# EAGLE schematic new (EAGLE 9.6.1)
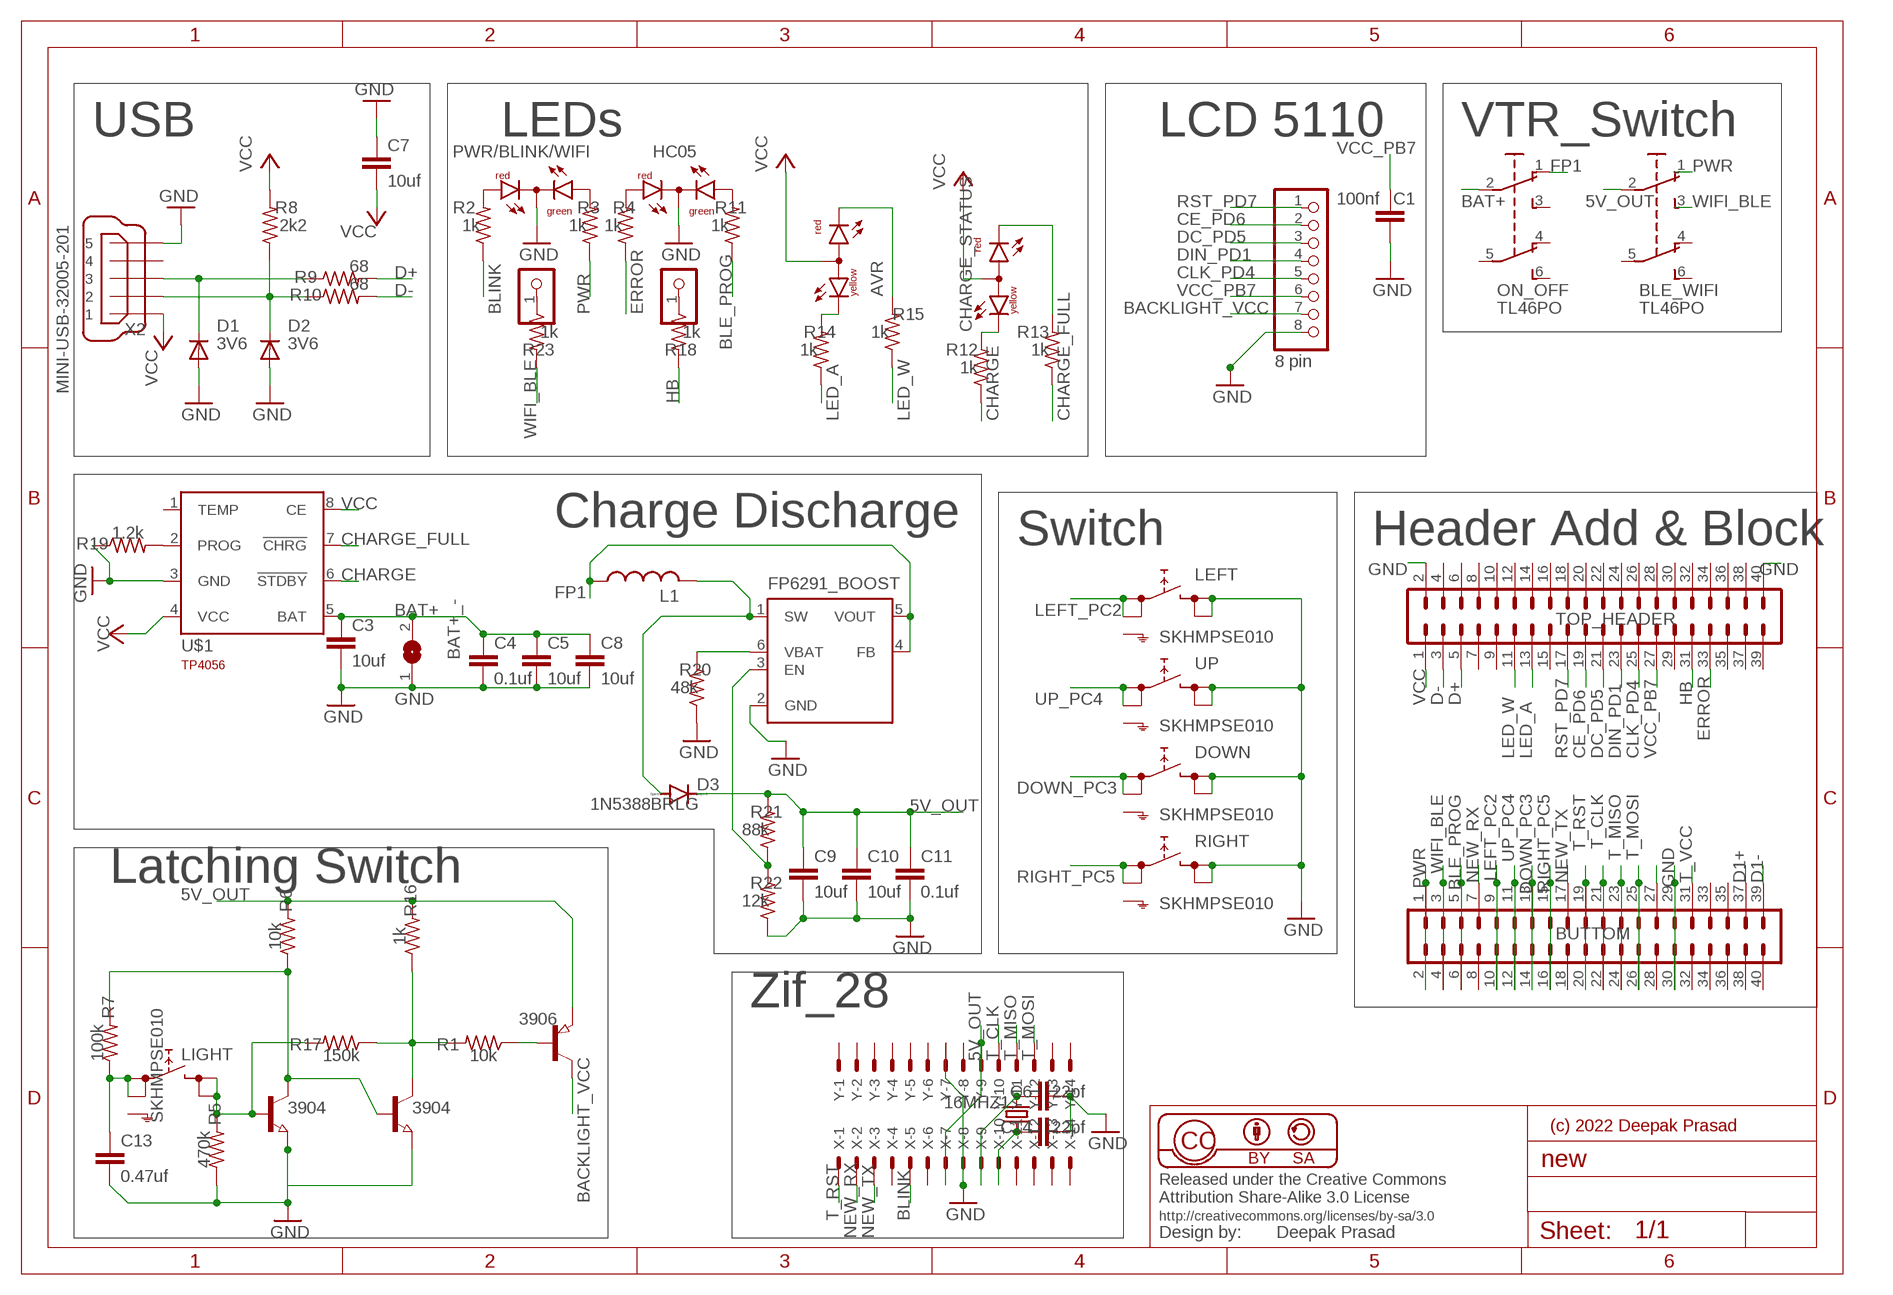
[diagram p0: schematic, sheet 1]

## Parts
16MHZ1  CSM-7X-DU  [CSM-7X-DU]
3906  PNP-TRANSISTOR_SOT23  [SOT23]
AVR  DUOLED-RY-A  [DUOLED-A-5MM]
BAT+_-  SJW  [SJW]
BLE_WIFI  TL46PO  [TL4XPO]
BUTTOM  MA20-2  [MA20-2]
C1  100nf  C-EUC1206  [C1206]
C3  10uf  C-EUC1206  [C1206]
C4  0.1uf  C-EUC1206  [C1206]
C5  10uf  C-EUC1206  [C1206]
C6  22pf  C-EUC1206  [C1206]
C7  10uf  C-EUC1206  [C1206]
C8  10uf  C-EUC1206  [C1206]
C9  10uf  C-EUC1206  [C1206]
C10  10uf  C-EUC1206  [C1206]
C11  0.1uf  C-EUC1206  [C1206]
C13  0.47uf  C-EUC1206  [C1206]
C14  22pf  C-EUC1206  [C1206]
CHARGE_STATUS  DUOLED-RY-A  [DUOLED-A-5MM]
D1  3V6  DIODESMA  [SMA-DIODE]
D2  3V6  DIODESMA  [SMA-DIODE]
D3  1N5388BRLG  DIODE-SMC  [SMC]
DOWN  SKHMPSE010  [SKHMPXE010]
FP6291_BOOST  TPS61070DDC  [TSOT23-6_DDC]
HC05  DUOLED-RG-C  [DUOLED-C-5MM]
JP1  8 pin  PINHD-1X8  [1X08]
JP2  PINHD-1X1  [1X01]
JP3  PINHD-1X1  [1X01]
L1  L-USPIS2816  [PIS2816]
LEFT  SKHMPSE010  [SKHMPXE010]
LIGHT  SKHMPSE010  [SKHMPXE010]
ON_OFF  TL46PO  [TL4XPO]
PWR/BLINK/WIFI  DUOLED-RG-C  [DUOLED-C-5MM]
Q2  3904  NPN-TRANSISTOR_SOT23  [SOT23]
Q3  3904  NPN-TRANSISTOR_SOT23  [SOT23]
R1  10k  R-US_CHIP-1206(3216-METRIC)  [RESC3216X70]
R2  1k  R-US_CHIP-1206(3216-METRIC)  [RESC3216X70]
R3  1k  R-US_CHIP-1206(3216-METRIC)  [RESC3216X70]
R4  1k  R-US_CHIP-1206(3216-METRIC)  [RESC3216X70]
R5  470k  R-US_CHIP-1206(3216-METRIC)  [RESC3216X70]
R6  10k  R-US_CHIP-1206(3216-METRIC)  [RESC3216X70]
R7  100k  R-US_CHIP-1206(3216-METRIC)  [RESC3216X70]
R8  2k2  R-US_CHIP-1206(3216-METRIC)  [RESC3216X70]
R9  68  R-US_CHIP-1206(3216-METRIC)  [RESC3216X70]
R10  68  R-US_CHIP-1206(3216-METRIC)  [RESC3216X70]
R11  1k  R-US_CHIP-1206(3216-METRIC)  [RESC3216X70]
R12  1k  R-US_CHIP-1206(3216-METRIC)  [RESC3216X70]
R13  1k  R-US_CHIP-1206(3216-METRIC)  [RESC3216X70]
R14  1k  R-US_CHIP-1206(3216-METRIC)  [RESC3216X70]
R15  1k  R-US_CHIP-1206(3216-METRIC)  [RESC3216X70]
R16  1k  R-US_CHIP-1206(3216-METRIC)  [RESC3216X70]
R17  150k  R-US_CHIP-1206(3216-METRIC)  [RESC3216X70]
R18  1k  R-US_CHIP-1206(3216-METRIC)  [RESC3216X70]
R19  1.2k  R-US_CHIP-1206(3216-METRIC)  [RESC3216X70]
R20  48k  R-US_CHIP-1206(3216-METRIC)  [RESC3216X70]
R21  88k  R-US_CHIP-1206(3216-METRIC)  [RESC3216X70]
R22  12k  R-US_CHIP-1206(3216-METRIC)  [RESC3216X70]
R23  1k  R-US_CHIP-1206(3216-METRIC)  [RESC3216X70]
RIGHT  SKHMPSE010  [SKHMPXE010]
TOP_HEADER  MA20-2  [MA20-2]
U$1  TP4056  [SOT23-8]
UP  SKHMPSE010  [SKHMPXE010]
X  C-GRID-14-70543  [70543-14]
X2  MINI-USB-32005-201  [32005-201]
Y  C-GRID-14-70543  [70543-14]

## Nets
5V_OUT: 3906.2(E) BLE_WIFI.2(P) C9.1 C10.1 C11.1 D3.C R6.2 R16.2 R21.2 X.7 Y.9
BACKLIGHT_VCC: 3906.3(C) JP1.7
BAT+: BAT+_-.2 C3.1 C4.1 C5.1 C8.1 ON_OFF.2(P) U$1.5(BAT)
BLE_PROG: BUTTOM.5 BUTTOM.6 R11.1
BLINK: R2.1 X.5
CE_PD6: JP1.2 TOP_HEADER.19
CHARGE: R12.1 U$1.6(!STDBY)
CHARGE_FULL: R13.1 U$1.7(!CHRG)
CLK_PD4: JP1.5 TOP_HEADER.25
D1+: BUTTOM.37
D1-: BUTTOM.39
D+: R9.2 TOP_HEADER.5
D-: R10.2 TOP_HEADER.3
DC_PD5: JP1.3 TOP_HEADER.21
DIN_PD1: JP1.4 TOP_HEADER.23
DOWN_PC3: BUTTOM.13 BUTTOM.14 DOWN.1(1.1) DOWN.2(1.2)
ERROR: R4.1 TOP_HEADER.33
FP1: FP6291_BOOST.4(FB) FP6291_BOOST.5(VOUT) L1.1 ON_OFF.1(O)
GND [POWER]: BAT+_-.1 BUTTOM.29 BUTTOM.30 C1.1 C3.2 C4.2 C5.2 C6.2 C7.1 C8.2 C9.2 C10.2 C11.2 C13.2 C14.2 D1.A D2.A DOWN.3(2.1) DOWN.4(2.2) FP6291_BOOST.2(GND) HC05.C JP1.8 LEFT.3(2.1) LEFT.4(2.2) PWR/BLINK/WIFI.C Q2.2(E) Q3.2(E) R5.1 R19.1 R20.1 R22.1 RIGHT.3(2.1) RIGHT.4(2.2) TOP_HEADER.2 TOP_HEADER.40 U$1.3(GND) UP.3(2.1) UP.4(2.2) X2.5 X.8 Y.7
HB: R18.2 TOP_HEADER.31
LED_A: R14.1 TOP_HEADER.13
LED_W: R15.1 TOP_HEADER.11
LEFT_PC2: BUTTOM.9 BUTTOM.10 LEFT.1(1.1) LEFT.2(1.2)
N$1: PWR/BLINK/WIFI.AR R2.2
N$2: PWR/BLINK/WIFI.AX(AG) R3.2
N$3: HC05.AR R4.2
N$4: HC05.AX(AG) R11.2
N$5: 3906.1(B) R1.1
N$6: D1.C R9.1 X2.3
N$7: D2.C R8.1 R10.1 X2.2
N$8: C13.1 LIGHT.1(1.1) LIGHT.2(1.2) R7.1
N$9: LIGHT.3(2.1) LIGHT.4(2.2) Q2.1(B) R5.2 R17.2
N$10: CHARGE_STATUS.CX(CY) R12.2
N$11: 16MHZ1.2 C6.1 X.9 Y.13
N$12: R19.2 U$1.2(PROG)
N$13: AVR.CX(CY) R14.2
N$14: CHARGE_STATUS.CR R13.2
N$15: AVR.CR R15.2
N$16: Q3.3(C) R1.2 R16.1 R17.1
N$17: D3.A FP6291_BOOST.1(SW) L1.2
N$18: FP6291_BOOST.6(VBAT) R20.2
N$19: Q2.3(C) Q3.1(B) R6.1 R7.2
N$20: FP6291_BOOST.3(EN) R21.1 R22.2
N$21: JP3.1 R18.1
N$22: JP2.1 R23.1
N$29: 16MHZ1.1 C14.1 X.10
N$41: BUTTOM.27
NEW_RX: BUTTOM.7 X.2
NEW_TX: BUTTOM.17 X.3
PWR: BLE_WIFI.1(O) BUTTOM.1 BUTTOM.2 R3.1
RIGHT_PC5: BUTTOM.15 BUTTOM.16 RIGHT.1(1.1) RIGHT.2(1.2)
RST_PD7: JP1.1 TOP_HEADER.17
T_CLK: BUTTOM.21 BUTTOM.22 Y.10
T_MISO: BUTTOM.23 BUTTOM.24 Y.11
T_MOSI: BUTTOM.25 BUTTOM.26 Y.12
T_RST: BUTTOM.19 BUTTOM.20 X.1
T_VCC: BUTTOM.31
UP_PC4: BUTTOM.11 BUTTOM.12 UP.1(1.1) UP.2(1.2)
VCC [POWER]: AVR.A C7.2 CHARGE_STATUS.A R8.2 TOP_HEADER.1 U$1.4(VCC) U$1.8(CE) X2.1
VCC_PB7: C1.2 JP1.6 TOP_HEADER.27
WIFI_BLE: BLE_WIFI.3(S) BUTTOM.3 BUTTOM.4 R23.2
Unconnected: BLE_WIFI.4(O1) BLE_WIFI.5(P1) BLE_WIFI.6(S1) BUTTOM.8 BUTTOM.18 BUTTOM.28 BUTTOM.32 BUTTOM.33 BUTTOM.34 BUTTOM.35 BUTTOM.36 BUTTOM.38 BUTTOM.40 DOWN.5(SH) LEFT.5(SH) LIGHT.5(SH) ON_OFF.3(S) ON_OFF.4(O1) ON_OFF.5(P1) ON_OFF.6(S1) RIGHT.5(SH) TOP_HEADER.4 TOP_HEADER.6 TOP_HEADER.7 TOP_HEADER.8 TOP_HEADER.9 TOP_HEADER.10 TOP_HEADER.12 TOP_HEADER.14 TOP_HEADER.15 TOP_HEADER.16 TOP_HEADER.18 TOP_HEADER.20 TOP_HEADER.22 TOP_HEADER.24 TOP_HEADER.26 TOP_HEADER.28 TOP_HEADER.29 TOP_HEADER.30 TOP_HEADER.32 TOP_HEADER.34 TOP_HEADER.35 TOP_HEADER.36 TOP_HEADER.37 TOP_HEADER.38 TOP_HEADER.39 U$1.1(TEMP) UP.5(SH) X2.4 X.4 X.6 X.11 X.12 X.13 X.14 Y.1 Y.2 Y.3 Y.4 Y.5 Y.6 Y.8 Y.14

## Notes on the sheet
- USB | LEDs | LCD 5110 | VTR_Switch
- Charge Discharge
- Switch | Header Add & Block
- Latching Switch
- Zif_28
- (c) 2022 Deepak Prasad

## Library data of the parts
16MHZ1 = crystal:CSM-7X-DU: SMD CRYSTAL Source: www.ecsxtal.com .. Crystal 3.6864MHz CSM_7X_DU.PDF; OC_FARNELL: unknown; OC_NEWARK: unknown
3906 = semicon-smd-ipc:PNP-TRANSISTOR_: PNP TRANSISTOR
AVR CHARGE_STATUS = led:DUOLED-RY-A: DUO LED 2 colors (red/yellow), 5 mm, round, common Anode www.ligitek.com or other producers.
BAT+_- = jumper:SJ: SMD solder JUMPER
BLE_WIFI ON_OFF = switch:TL46PO: TINY SWITCH ON - ON Source: http://www2.produktinfo.conrad.com/datenblaetter/700000-724999/705152-da-01-de-Subminiaturschalter_TL_36YO.pdf
BUTTOM TOP_HEADER = con-lstb:MA20-2: PIN HEADER; OC_FARNELL: unknown; OC_NEWARK: unknown
C1 C3-C11 C13 C14 = rcl:C-EU: CAPACITOR, European symbol; SPICEPREFIX: C
D1 D2 = sparkfun:DIODE: Diode These are standard reverse protection diodes and small signal diodes. SMA package can handle up to about 1A. SOD-323 can handle about 200mA. What the SOD-323 package when ordering, there are some mfgs out there that are 5-pin packages.
D3 = diode:DIODE-: DIODE
DOWN LEFT LIGHT RIGHT UP = switch:SKHMP*E010: 6.2 X 6.5mm TACT Switch (SMD) Source: http://www3.alps.co.jp/WebObjects/catalog.woa/PDF/E/Switch/Tact/SKHM/SKHM.PDF
FP6291_BOOST = texas:TPS6107*: 90% EFFICIENT SYNCHRONOUS BOOST CONVERTER WITH 600-mA SWITCH Source: http://focus.ti.com/lit/ds/symlink/tps61070.pdf; MPN: TPS61070DDCR; OC_FARNELL: 1461062; OC_NEWARK: 64M3125
HC05 PWR/BLINK/WIFI = led:DUOLED-RG-C: DUO LED 2 colors (red/green), 5 mm, round, common Cathode www.ligitek.com or other producers.
JP1 = pinhead:PINHD-1X8: PIN HEADER
JP2 JP3 = pinhead:PINHD-1X1: PIN HEADER
L1 = rcl:L-US: INDUCTOR, American symbol; SPICEPREFIX: L
Q2 Q3 = semicon-smd-ipc:NPN-TRANSISTOR_: NPN TRANSISTOR
R1-R23 = Resistor:R-US: Resistor Fixed - ANSI; CATEGORY: Resistor; SUB-CATEGORY: Fixed
U$1 = TP4056:TP4056: TP4056 Data sheet <http://goo.gl/J7k8TF> Dave.Calaway Eagle Library <https://goo.gl/Muy1Tr>
X Y = con-molex:C-GRID-14: CONNECTOR wire to board 2.54 mm (0.100") pitch header; MF: MOLEX; OC_FARNELL: unknown; OC_NEWARK: unknown
X2 = con-cypressindustries:MINI-USB-: MINI USB-B Conector Source: www.cypressindustries.com; OC_FARNELL: unknown; OC_NEWARK: unknown

## Net classes
0 default: width 0.254 mm, clearance 0.254 mm
1 POWER: width 0.254 mm, clearance 0.254 mm